# EAGLE design G772B (EAGLE 6.6.0)
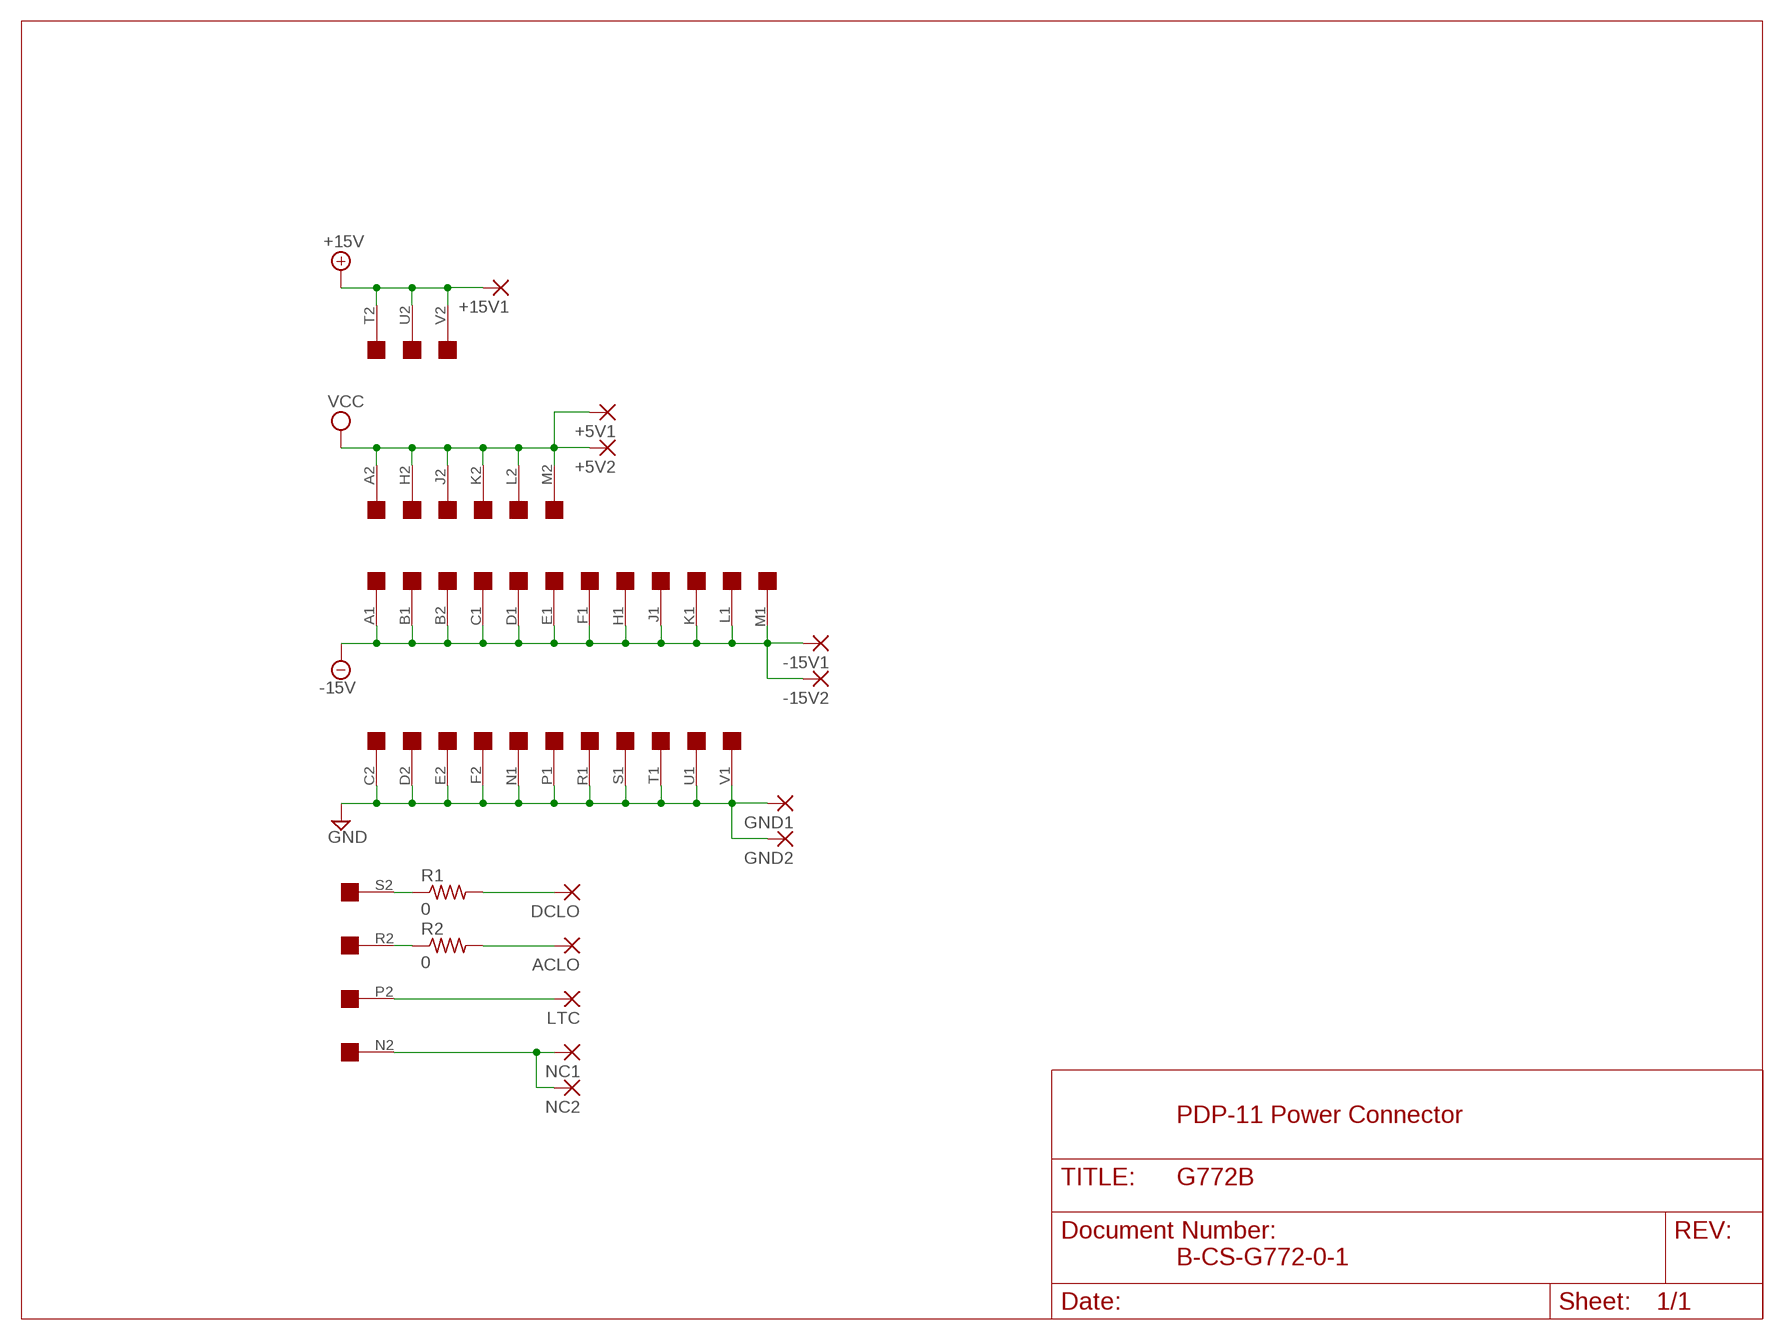
[diagram p0: schematic, sheet 1]

## Parts
+5V1  2,54/1,0  [2,54/1,0]
+5V2  2,54/1,0  [2,54/1,0]
+15V1  2,54/1,0  [2,54/1,0]
-15V1  2,54/1,0  [2,54/1,0]
-15V2  2,54/1,0  [2,54/1,0]
ACLO  2,54/1,0  [2,54/1,0]
DCLO  2,54/1,0  [2,54/1,0]
GND1  2,54/1,0  [2,54/1,0]
GND2  2,54/1,0  [2,54/1,0]
LTC  2,54/1,0  [2,54/1,0]
NC1  2,54/1,0  [2,54/1,0]
NC2  2,54/1,0  [2,54/1,0]
R1  0  R-US_0207/10  [0207/10]
R2  0  R-US_0207/10  [0207/10]
U$1  SINGLE  [EDGE-CON2]

## Nets
+15V: +15V1.1(P) U$1.T2 U$1.U2 U$1.V2
-15V: -15V1.1(P) -15V2.1(P) U$1.A1 U$1.B1 U$1.B2 U$1.C1 U$1.D1 U$1.E1 U$1.F1 U$1.H1 U$1.J1 U$1.K1 U$1.L1 U$1.M1
ACLO: ACLO.1(P) R2.2
DCLO: DCLO.1(P) R1.2
GND: GND1.1(P) GND2.1(P) U$1.C2 U$1.D2 U$1.E2 U$1.F2 U$1.N1 U$1.P1 U$1.R1 U$1.S1 U$1.T1 U$1.U1 U$1.V1
LTC: LTC.1(P) U$1.P2
N$1: R2.1 U$1.R2
N$2: R1.1 U$1.S2
NC: NC1.1(P) NC2.1(P) U$1.N2
VCC: +5V1.1(P) +5V2.1(P) U$1.A2 U$1.H2 U$1.J2 U$1.K2 U$1.L2 U$1.M2

## Notes on the sheet
- PDP-11 Power Connector
- B-CS-G772-0-1

## Library data of the parts
+5V1 +5V2 +15V1 -15V1 -15V2 ACLO DCLO GND1 GND2 LTC NC1 NC2 = wirepad:2,54/1,0: THROUGH-HOLE PAD
R1 R2 = rcl:R-US_: RESISTOR, American symbol
U$1 = dec-con:SINGLE: Single-Height DEC board

## Net classes
0 default: width 0.813 mm

## Board
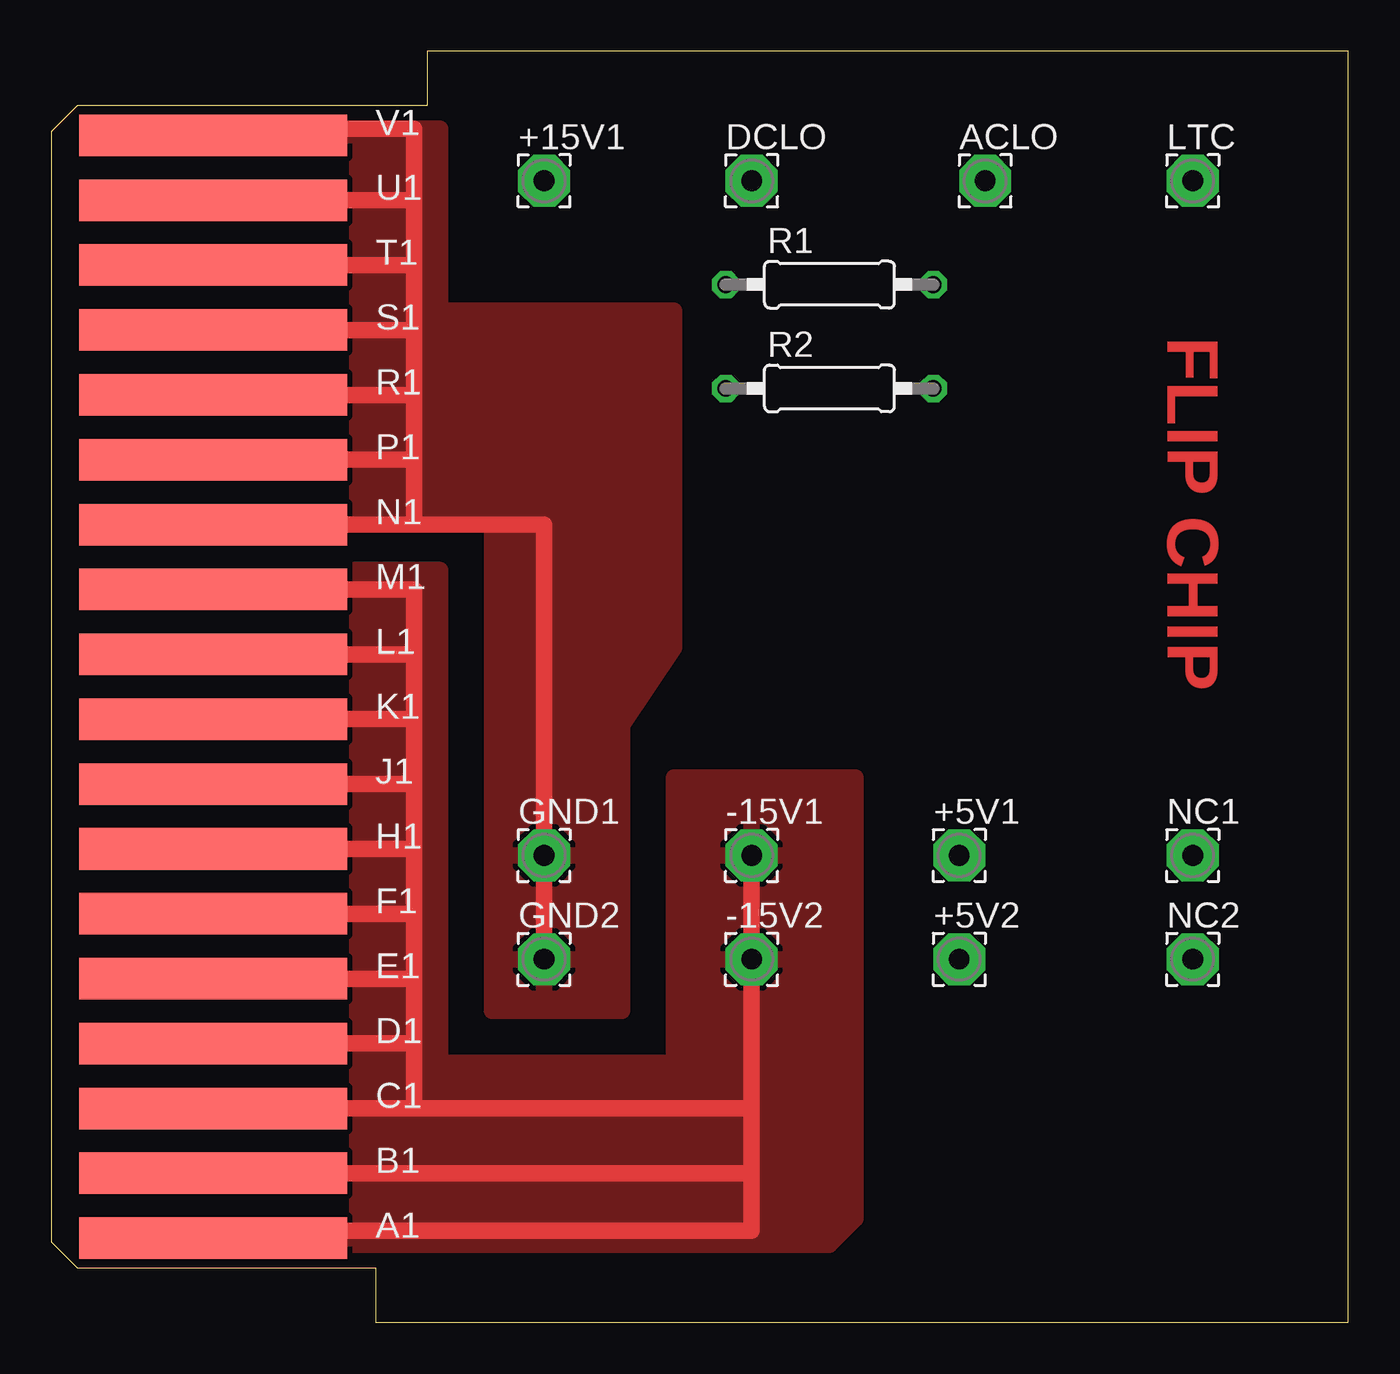
[diagram p1: board, top side]
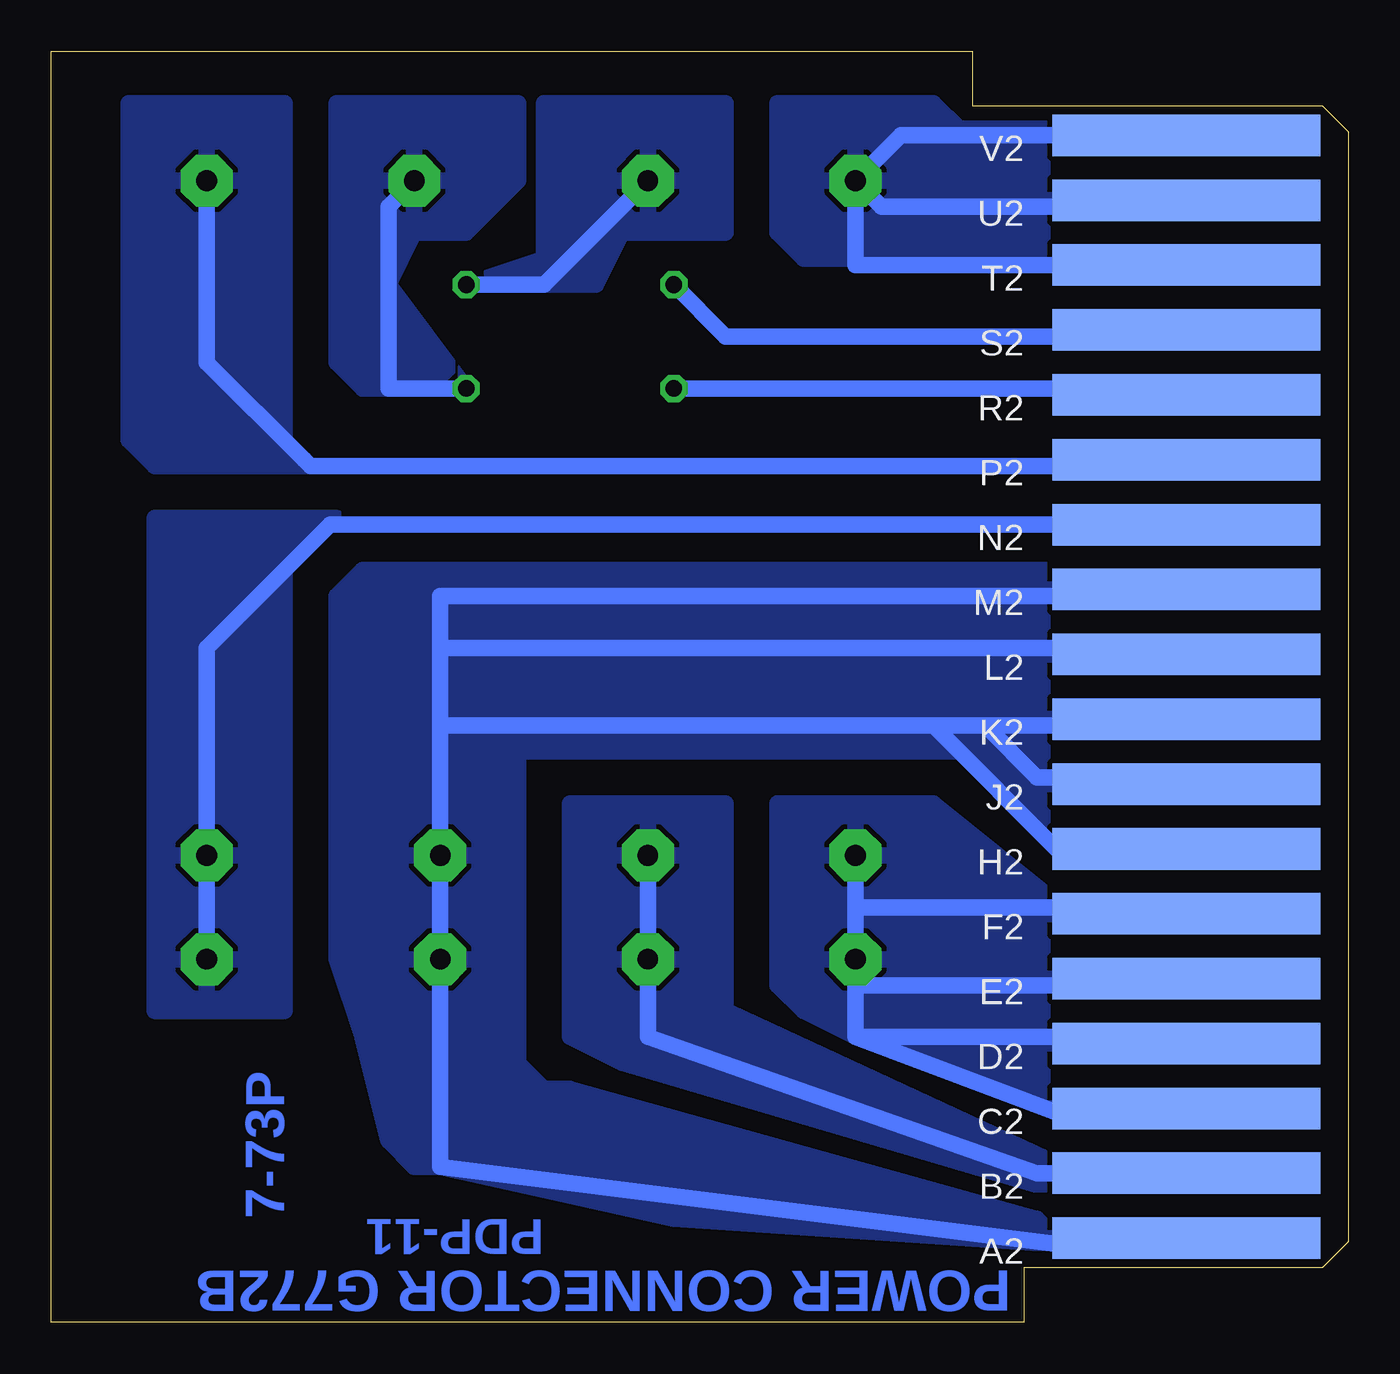
[diagram p2: board, bottom side, seen from below]

Size 63.5 x 62.23 mm. Coordinates in mm from the lower left corner, seen from the top.
Outline: 15.88,0 63.5,0 63.5,62.23 18.41,62.23 18.41,61.59
Copper layers (1+16): Top 0.035mm / dielectric 1.5mm / Bottom 0.035mm
Design rules "16mils": minimum track width 16mil, minimum drill 32mil, track to track 15mil, track to pad 10mil, pad to pad 10mil, via to via 10mil, smd to smd 10mil, copper to edge 13mil, drill to drill 10mil, minimum pad ring 10mil, minimum via ring 8mil, stop-mask expansion 0mil, vias tented up to drill 0mil, thermal gap 10mil

### Footprints (pad centres in the part's own frame; a part is rotated, then mirrored left to right if it is on the bottom)
2,54/1,0 = drill 1.016 pad 2.54 octagon: 1 0,0
0207/10 = drill 0.813 octagon: 1 -5.08,0; 2 5.08,0
EDGE-CON2 = smd 13.106 x 2.032: A1 7.938,4.128; B1 7.938,7.303; C1 7.938,10.477; D1 7.938,13.652; E1 7.938,16.828; F1 7.938,20.003; H1 7.938,23.177; J1 7.938,26.352; K1 7.938,29.527; L1 7.938,32.703; M1 7.938,35.877; N1 7.938,39.053; P1 7.938,42.227; R1 7.938,45.403; S1 7.938,48.578; T1 7.938,51.752; U1 7.938,54.928; V1 7.938,58.102 | smd 13.106 x 2.032 bottom: A2 7.938,4.128; B2 7.938,7.303; C2 7.938,10.477; D2 7.938,13.652; E2 7.938,16.828; F2 7.938,20.003; H2 7.938,23.177; J2 7.938,26.352; K2 7.938,29.527; L2 7.938,32.703; M2 7.938,35.877; N2 7.938,39.053; P2 7.938,42.227; R2 7.938,45.403; S2 7.938,48.578; T2 7.938,51.752; U2 7.938,54.928; V2 7.938,58.102

### Placement (x,y rotation side)
+5V1  44.45,22.86 0 top
+5V2  44.45,17.78 0 top
+15V1  24.13,55.88 0 top
-15V1  34.29,22.86 0 top
-15V2  34.29,17.78 0 top
ACLO  45.72,55.88 0 top
DCLO  34.29,55.88 0 top
GND1  24.13,22.86 0 top
GND2  24.13,17.78 0 top
LTC  55.88,55.88 0 top
NC1  55.88,22.86 0 top
NC2  55.88,17.78 0 top
R1  38.1,50.8 0 top
R2  38.1,45.72 0 top
U$1  0,0 0 top

### Tracks (layer width: path | path; a pad name or v marks a point on that pad's centre or on a via)
+15V
  Bottom 0.813: U$1.U2 8.57,54.93 8.89,54.61 22.86,54.61 +15V1.1 | U$1.V2 21.91,58.1 +15V1.1 | U$1.T2 24.13,51.75 +15V1.1
  pour Bottom: 13.97,58.42 13.97,52.07 26.67,52.07 27.94,53.34 27.94,59.69 20.32,59.69 19.05,58.42
-15V
  Top 0.813: U$1.A1 8.53,4.13 8.89,4.49 34.29,4.49 34.29,7.3 | 34.29,7.3 34.29,10.48 | 34.29,10.48 -15V2.1 -15V1.1 | U$1.B1 34.29,7.3 | U$1.C1 17.78,10.48 | 17.78,10.48 34.29,10.48 | U$1.D1 17.78,13.65 | 17.78,13.65 17.78,10.48 | U$1.M1 17.78,35.88 17.78,32.7 | 17.78,32.7 17.78,29.53 | 17.78,29.53 17.78,26.35 | 17.78,26.35 17.78,23.18 | 17.78,23.18 17.78,20 | 17.78,20 17.78,16.83 | 17.78,16.83 17.78,13.65 | U$1.E1 17.78,16.83 | U$1.F1 17.78,20 | U$1.H1 17.78,23.18 | U$1.J1 17.78,26.35 | U$1.K1 17.78,29.53 | U$1.L1 17.78,32.7
  Bottom 0.813: -15V1.1 -15V2.1 34.29,13.97 15.24,7.3 U$1.B1
  pour Bottom: 13.97,6.35 35.56,12.7 38.1,13.97 38.1,25.4 30.48,25.4 30.48,15.24 13.97,7.62
  pour Top: 13.97,36.83 13.97,3.81 38.1,3.81 39.37,5.08 39.37,26.67 30.48,26.67 30.48,12.7 19.05,12.7 19.05,36.83
ACLO
  Bottom 0.813: R2.2 46.99,45.72 46.99,54.61 ACLO.1
  pour Bottom: 40.64,59.69 40.64,55.88 43.18,53.34 45.72,53.34 46.99,50.8 43.18,45.72 48.26,45.72 49.53,46.99 49.53,59.69
DCLO
  Bottom 0.813: DCLO.1 39.37,50.8 R1.2
  pour Bottom: 30.48,59.69 30.48,53.34 35.56,53.34 36.83,50.8 43.18,50.8 39.37,52.07 39.37,59.69
GND
  Top 0.813: U$1.N1 17.78,39.05 | 17.78,39.05 24.13,39.05 GND1.1 GND2.1 | U$1.V1 8.89,58.1 8.89,58.42 17.78,58.42 17.78,54.93 | 17.78,51.75 17.78,54.61 17.78,54.93 | 17.78,51.75 17.78,48.58 | 17.78,48.58 17.78,45.4 | 17.78,45.4 17.78,42.23 | 17.78,42.23 17.78,39.05 | U$1.P1 17.78,42.23 | U$1.R1 17.78,45.4 | U$1.S1 17.78,48.58 | U$1.T1 17.78,51.75 | U$1.U1 17.78,54.93
  Bottom 0.813: 24.13,20.32 GND2.1 24.13,16.51 | 24.13,20.32 GND1.1 | U$1.C2 13.97,10.16 24.13,13.97 | 24.13,13.97 24.13,16.51 | U$1.D2 8.89,13.97 24.13,13.97 | U$1.E2 8.89,16.51 24.13,16.51 | U$1.F2 8.89,20.32 24.13,20.32
  pour Bottom: 13.97,20.32 13.97,10.16 24.13,13.97 26.67,15.24 27.94,16.51 27.94,25.4 20.32,25.4
  pour Top: 13.97,58.42 13.97,39.37 21.59,39.37 21.59,15.24 27.94,15.24 27.94,29.21 30.48,33.02 30.48,49.53 19.05,49.53 19.05,58.42
LTC
  Bottom 0.813: U$1.P2 8.89,41.91 50.8,41.91 51.12,42.23 55.88,46.99 LTC.1
  pour Bottom: 52.07,59.69 52.07,43.18 50.8,41.91 58.42,41.91 59.69,43.18 59.69,59.69
N$1
  Bottom 0.813: U$1.R2 8.57,45.4 8.89,45.72 R2.1
N$2
  Bottom 0.813: U$1.S2 8.89,48.58 8.89,48.26 30.48,48.26 R1.1
NC
  Bottom 0.813: U$1.N2 49.85,39.05 55.88,33.02 NC1.1 NC2.1
  pour Bottom: 49.53,39.37 58.42,39.37 58.42,15.24 52.07,15.24 52.07,36.83
VCC
  Bottom 0.813: U$1.M2 8.57,35.88 8.89,35.56 44.45,35.56 44.45,33.02 | 44.45,33.02 44.45,29.21 | 44.45,29.21 +5V1.1 +5V2.1 44.45,7.62 13.97,3.81 8.89,3.81 8.57,4.13 U$1.A2 | U$1.L2 8.57,32.7 8.89,33.02 44.45,33.02 | U$1.K2 8.57,29.53 8.89,29.21 17.78,29.21 | 17.78,29.21 20.32,29.21 | 20.32,29.21 44.45,29.21 | U$1.J2 8.57,26.35 8.89,26.67 15.24,26.67 17.78,29.21 | U$1.H2 8.57,23.18 8.89,22.86 13.97,22.86 20.32,29.21
  pour Bottom: 13.97,36.83 13.97,22.86 19.05,27.94 40.64,27.94 40.64,12.7 39.37,11.43 38.1,11.43 15.24,5.08 13.97,3.81 33.02,5.08 44.45,7.62 45.72,7.62 46.99,8.89 48.26,13.97 49.53,17.78 49.53,35.56 48.26,36.83

### Text on the board
Top: FLIP CHIP
Bottom: PDP-11 | 7-73P | POWER CONNECTOR G772B